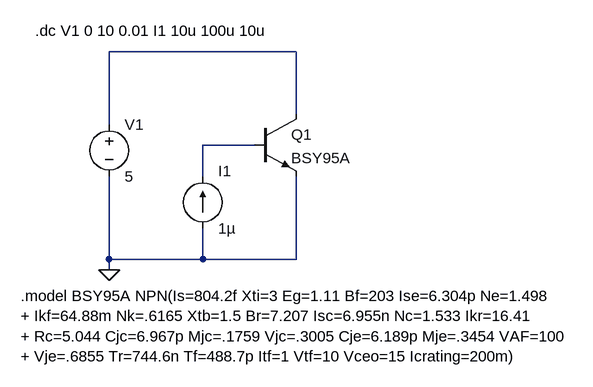
[diagram p0: schematic BSY95_B_VAF_test.asc]
BSY95_B_VAF_test.asc, the LTspice schematic file:
Version 4
SHEET 1 928 680
WIRE 400 -320 112 -320
WIRE 400 -224 400 -320
WIRE 112 -208 112 -320
WIRE 336 -176 256 -176
WIRE 256 -128 256 -176
WIRE 112 0 112 -128
WIRE 256 0 256 -48
WIRE 256 0 112 0
WIRE 400 0 400 -128
WIRE 400 0 256 0
WIRE 112 16 112 0
FLAG 112 16 0
SYMBOL npn 336 -224 R0
SYMATTR InstName Q1
SYMATTR Value BSY95A
SYMBOL voltage 112 -224 R0
SYMATTR InstName V1
SYMATTR Value 5
SYMBOL current 256 -48 M180
WINDOW 0 24 88 Left 0
WINDOW 3 24 0 Left 0
SYMATTR InstName I1
SYMATTR Value 1µ
TEXT -24 56 Left 0 !.model BSY95A NPN(Is=804.2f Xti=3 Eg=1.11 Bf=203 Ise=6.304p Ne=1.498\n+ Ikf=64.88m Nk=.6165 Xtb=1.5 Br=7.207 Isc=6.955n Nc=1.533 Ikr=16.41\n+ Rc=5.044 Cjc=6.967p Mjc=.1759 Vjc=.3005 Cje=6.189p Mje=.3454 VAF=100\n+ Vje=.6855 Tr=744.6n Tf=488.7p Itf=1 Vtf=10 Vceo=15 Icrating=200m)
TEXT -2 -352 Left 0 !.dc V1 0 10 0.01 I1 10u 100u 10u

The netlist it stands for:
* BSY95_B_VAF_test.asc
Q1 N001 N002 0 0 BSY95A
V1 N001 0 5
I1 0 N002 1µ
.model NPN NPN
.model PNP PNP
.lib standard.bjt
.model BSY95A NPN(Is=804.2f Xti=3 Eg=1.11 Bf=203 Ise=6.304p Ne=1.498
+ Ikf=64.88m Nk=.6165 Xtb=1.5 Br=7.207 Isc=6.955n Nc=1.533 Ikr=16.41
+ Rc=5.044 Cjc=6.967p Mjc=.1759 Vjc=.3005 Cje=6.189p Mje=.3454 VAF=100
+ Vje=.6855 Tr=744.6n Tf=488.7p Itf=1 Vtf=10 Vceo=15 Icrating=200m)
.dc V1 0 10 0.01 I1 10u 100u 10u
.backanno
.end